# Altium schematic sheet EBoxschematic.SchDoc
size A; SheetNumber: 1; SheetTotal: 2
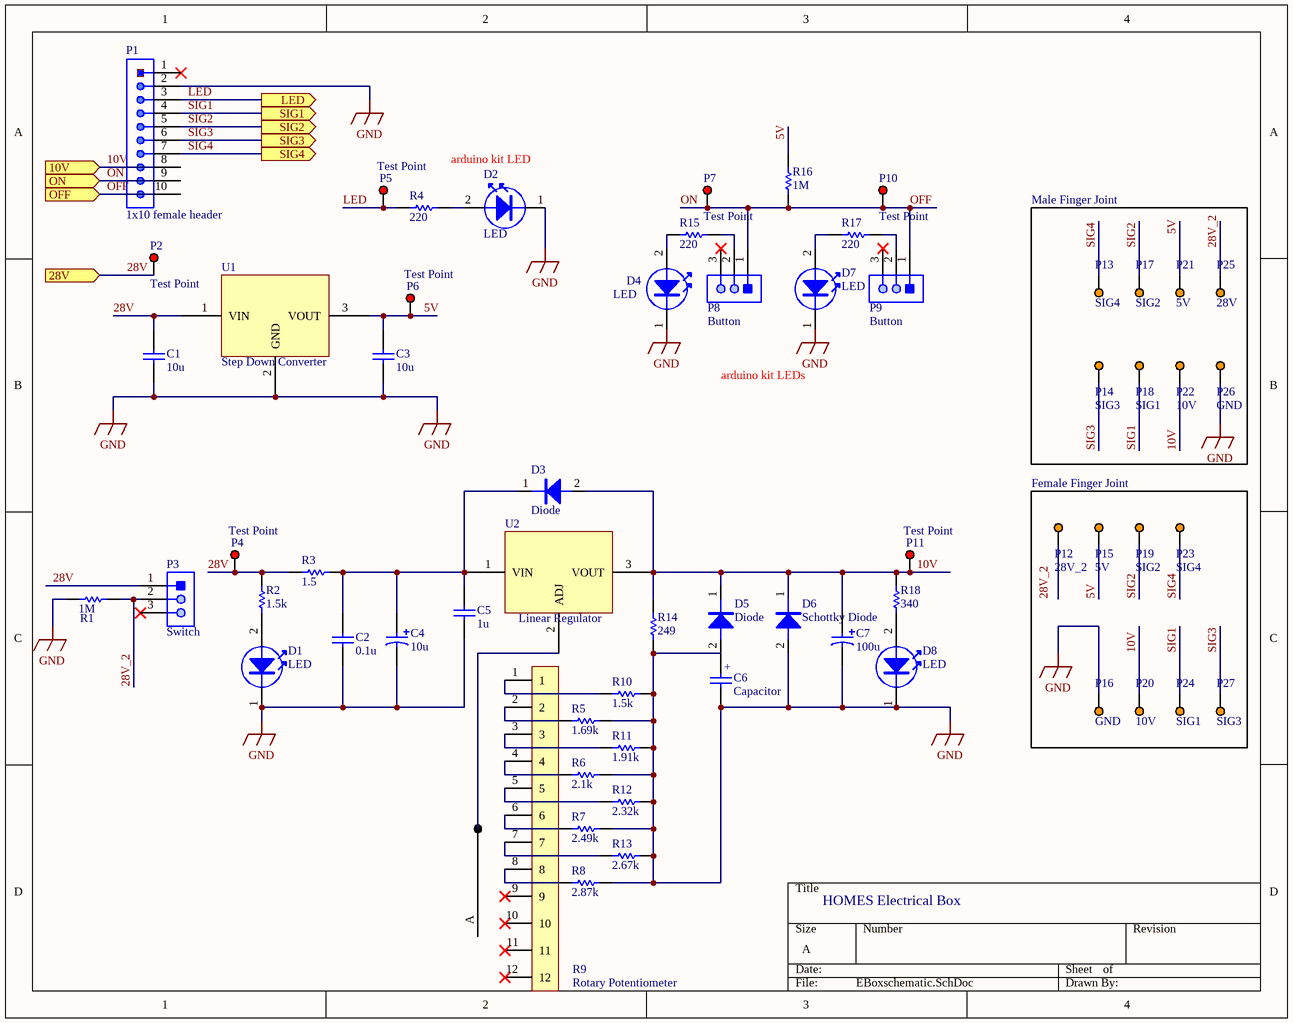
[diagram p0: EBoxschematic.SchDoc]

## Parts
C1  10u  [10uF]
C2  0.1u  [0.1uF]
C3  10u  [10uF]
C4  10u  [10uF Tantalum]
C5  1u  [1uF]
C6  Capacitor  [1uF]
C7  100u  [100uF Tantalum]
D1  LED  [LED 12V Thru Hole]
D2  LED  [LED 5V Arduino Thru Hole]
D3  Diode  [Protective Diode]
D4  LED  [LED 5V Arduino Thru Hole]
D5  Diode  [Protective Diode]
D6  Schottky Diode  [Schottky Diode]
D7  LED  [LED 5V Arduino Thru Hole]
D8  LED  [LED 5V Thru Hole]
P1  1x10 female header  [1x10 header pin]
P2  Test Point  [Test Point]
P3  Switch  [3x1 KK Molex]
P4  Test Point  [Test Point]
P5  Test Point  [Test Point]
P6  Test Point  [Test Point]
P7  Test Point  [Test Point]
P8  Button  [3x1 KK Molex]
P9  Button  [3x1 KK Molex]
P10  Test Point  [Test Point]
P11  Test Point  [Test Point]
P12  28V_2  [Via]
P13  SIG4  [Via]
P14  SIG3  [Via]
P15  5V  [Via]
P16  GND  [Via]
P17  SIG2  [Via]
P18  SIG1  [Via]
P19  SIG2  [Via]
P20  10V  [Via]
P21  5V  [Via]
P22  10V  [Via]
P23  SIG4  [Via]
P24  SIG1  [Via]
P25  28V  [Via]
P26  GND  [Via]
P27  SIG3  [Via]
R1  1M  [Arduino Resistors]
R2  1.5k  [1.5k Ohm]
R3  1.5  [1.5 Ohm]
R4  220  [Arduino Resistors]
R5  1.69k  [1.69k Ohm]
R6  2.1k  [2.1k Ohm]
R7  2.49k  [2.49k Ohm]
R8  2.87k  [2.87k Ohm]
R9  Rotary Potentiometer  [Rotary Switch]
R10  1.5k  [1.5k Ohm]
R11  1.91k  [1.91k Ohm]
R12  2.32k  [2.32k Ohm]
R13  2.67k  [2.67k Ohm]
R14  249  [249 Ohm]
R15  220  [Arduino Resistors]
R16  1M  [Arduino Resistors]
R17  220  [Arduino Resistors]
R18  340  [340 Ohm]
U1  Step Down Converter  [Step Down Converter]
U2  Linear Regulator  [Linear Regulator]

## Blocks framed on the sheet
Male Finger Joint: P13 P14 P17 P18 P21 P22 P25 P26
Female Finger Joint: P12 P15 P16 P19 P20 P23 P24 P27

## Ports
10V (in), 28V (in), LED (out), OFF (in), ON (in), SIG1 (out), SIG2 (out), SIG3 (out), SIG4 (out)

## Nets
GND: C1.1 C2.1 C3.1 C4.1 C5.1 C6.1 C6.2 C7.1 D1.1 D2.1 D4.1 D7.1 D8.1 P16.1 P26.1 R1.1 R5.2 R6.2 R7.2 R8.2 R10.2 R11.2 R12.2 R13.2 R14.2 U1.2(GND)
5V: C3.2 P6.1 P15.1 P21.1 R16.1 U1.3(VOUT)
10V: C7.2 D6.1 P1.8 P11.1 P20.1 P22.1 R14.1 R18.1 U2.3(VOUT) ; port 10V
28V: C1.2 P2.1 P3.1 P4.1 R2.1 R3.2 U1.1(VIN) ; port 28V
28V_2: P3.2 P25.1 R1.2
LED: P5.1 R4.2 ; port LED
OFF: P1.9 P1.10 P7.1 P8.1 P9.1 P10.1 R16.2 ; port ON, port OFF  [also labelled ON]
SIG1: P18.1 P24.1 ; port SIG1
SIG2: P17.1 P19.1 ; port SIG2
SIG3: P14.1 P27.1 ; port SIG3
SIG4: P13.1 P23.1 ; port SIG4
NetC2_2: C2.2 C4.2 C5.2 R3.1 U2.1(VIN)
NetD1_2: D1.2 R2.2
NetD2_2: D2.2 R4.1
NetD4_2: D4.2 R15.2
NetD7_2: D7.2 R17.2
NetD8_2: D8.2 R18.2
NetP8_2: P8.2 R15.1
NetP9_2: P9.2 R17.1
NetR5_1: R5.1 R9.2
NetR6_1: R6.1 R9.4
NetR7_1: R7.1 R9.6
NetR8_1: R8.1 R9.8
NetR9_1: R9.1 R10.1
NetR9_3: R9.3 R11.1
NetR9_5: R9.5 R12.1
NetR9_7: R9.7 R13.1
NetR9_A: R9.A U2.2(ADJ)

Not connected (* = marked no-connect by the designer): D3 1 2; D5 1 2; D6 2; P1 1 2 3 4 5 6 7; P3 3*; P8 3*; P9 3*; P12 1; R9 9* 10* 11* 12*

## Notes on the sheet
- arduino kit LED
- arduino kit LEDs
- (near C6) +
- HOMES Electrical Box
- Labels drawn without touching a wire or pin: 28V_2

## Library data of the parts
C1-C3 C5 = Capacitor
C4 C7 = Tantalum Capacitor
D6 = Diode
P1 = 1x10 female header: 5-535541-8
P3 P8 P9 = KK 254 1x3 male header: 22112032
P12-P27 = Output Point
R1-R8 R10-R18 = Resistor
U1 = Step Down Converter: R-78E5.0-1.0
U2 = Linear Regulator: 511-LM317BT